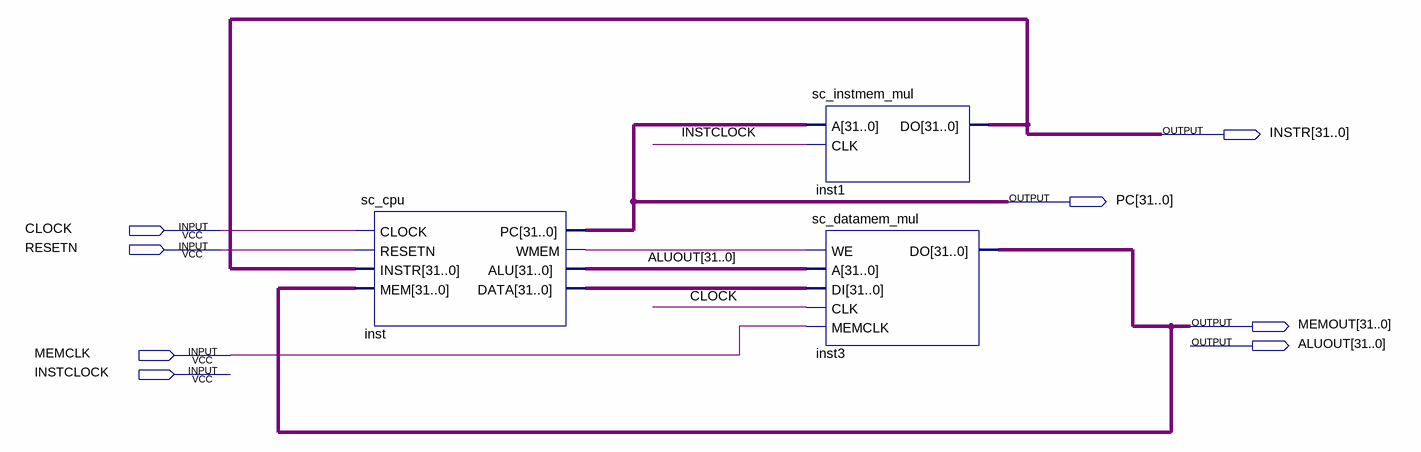
[diagram p0: schematic sheet]
// Quartus schematic cpu_mul.bdf as structural Verilog: 3 symbols, 8 pins
module cpu_mul (
  input  CLOCK,
  input  RESETN,
  input  MEMCLK,
  input  INSTCLOCK,
  output [31:0] INSTR,
  output [31:0] PC,
  output [31:0] MEMOUT,
  output [31:0] ALUOUT
);

  wire inst_wmem;
  wire [31:0] inst_data;

  sc_cpu inst (
    .CLOCK(CLOCK), .RESETN(RESETN), .INSTR(INSTR), .MEM(MEMOUT), .PC(PC), .WMEM(inst_wmem), .ALU(ALUOUT),
    .DATA(inst_data));
  sc_instmem_mul inst1 (.A(PC), .CLK(INSTCLOCK), .DO(INSTR));
  sc_datamem_mul inst3 (.WE(inst_wmem), .A(ALUOUT), .DI(inst_data), .CLK(CLOCK), .MEMCLK(MEMCLK), .DO(MEMOUT));
endmodule
